# EAGLE design bpf-L-band-BPF-A1340+ (EAGLE 9.2.2)
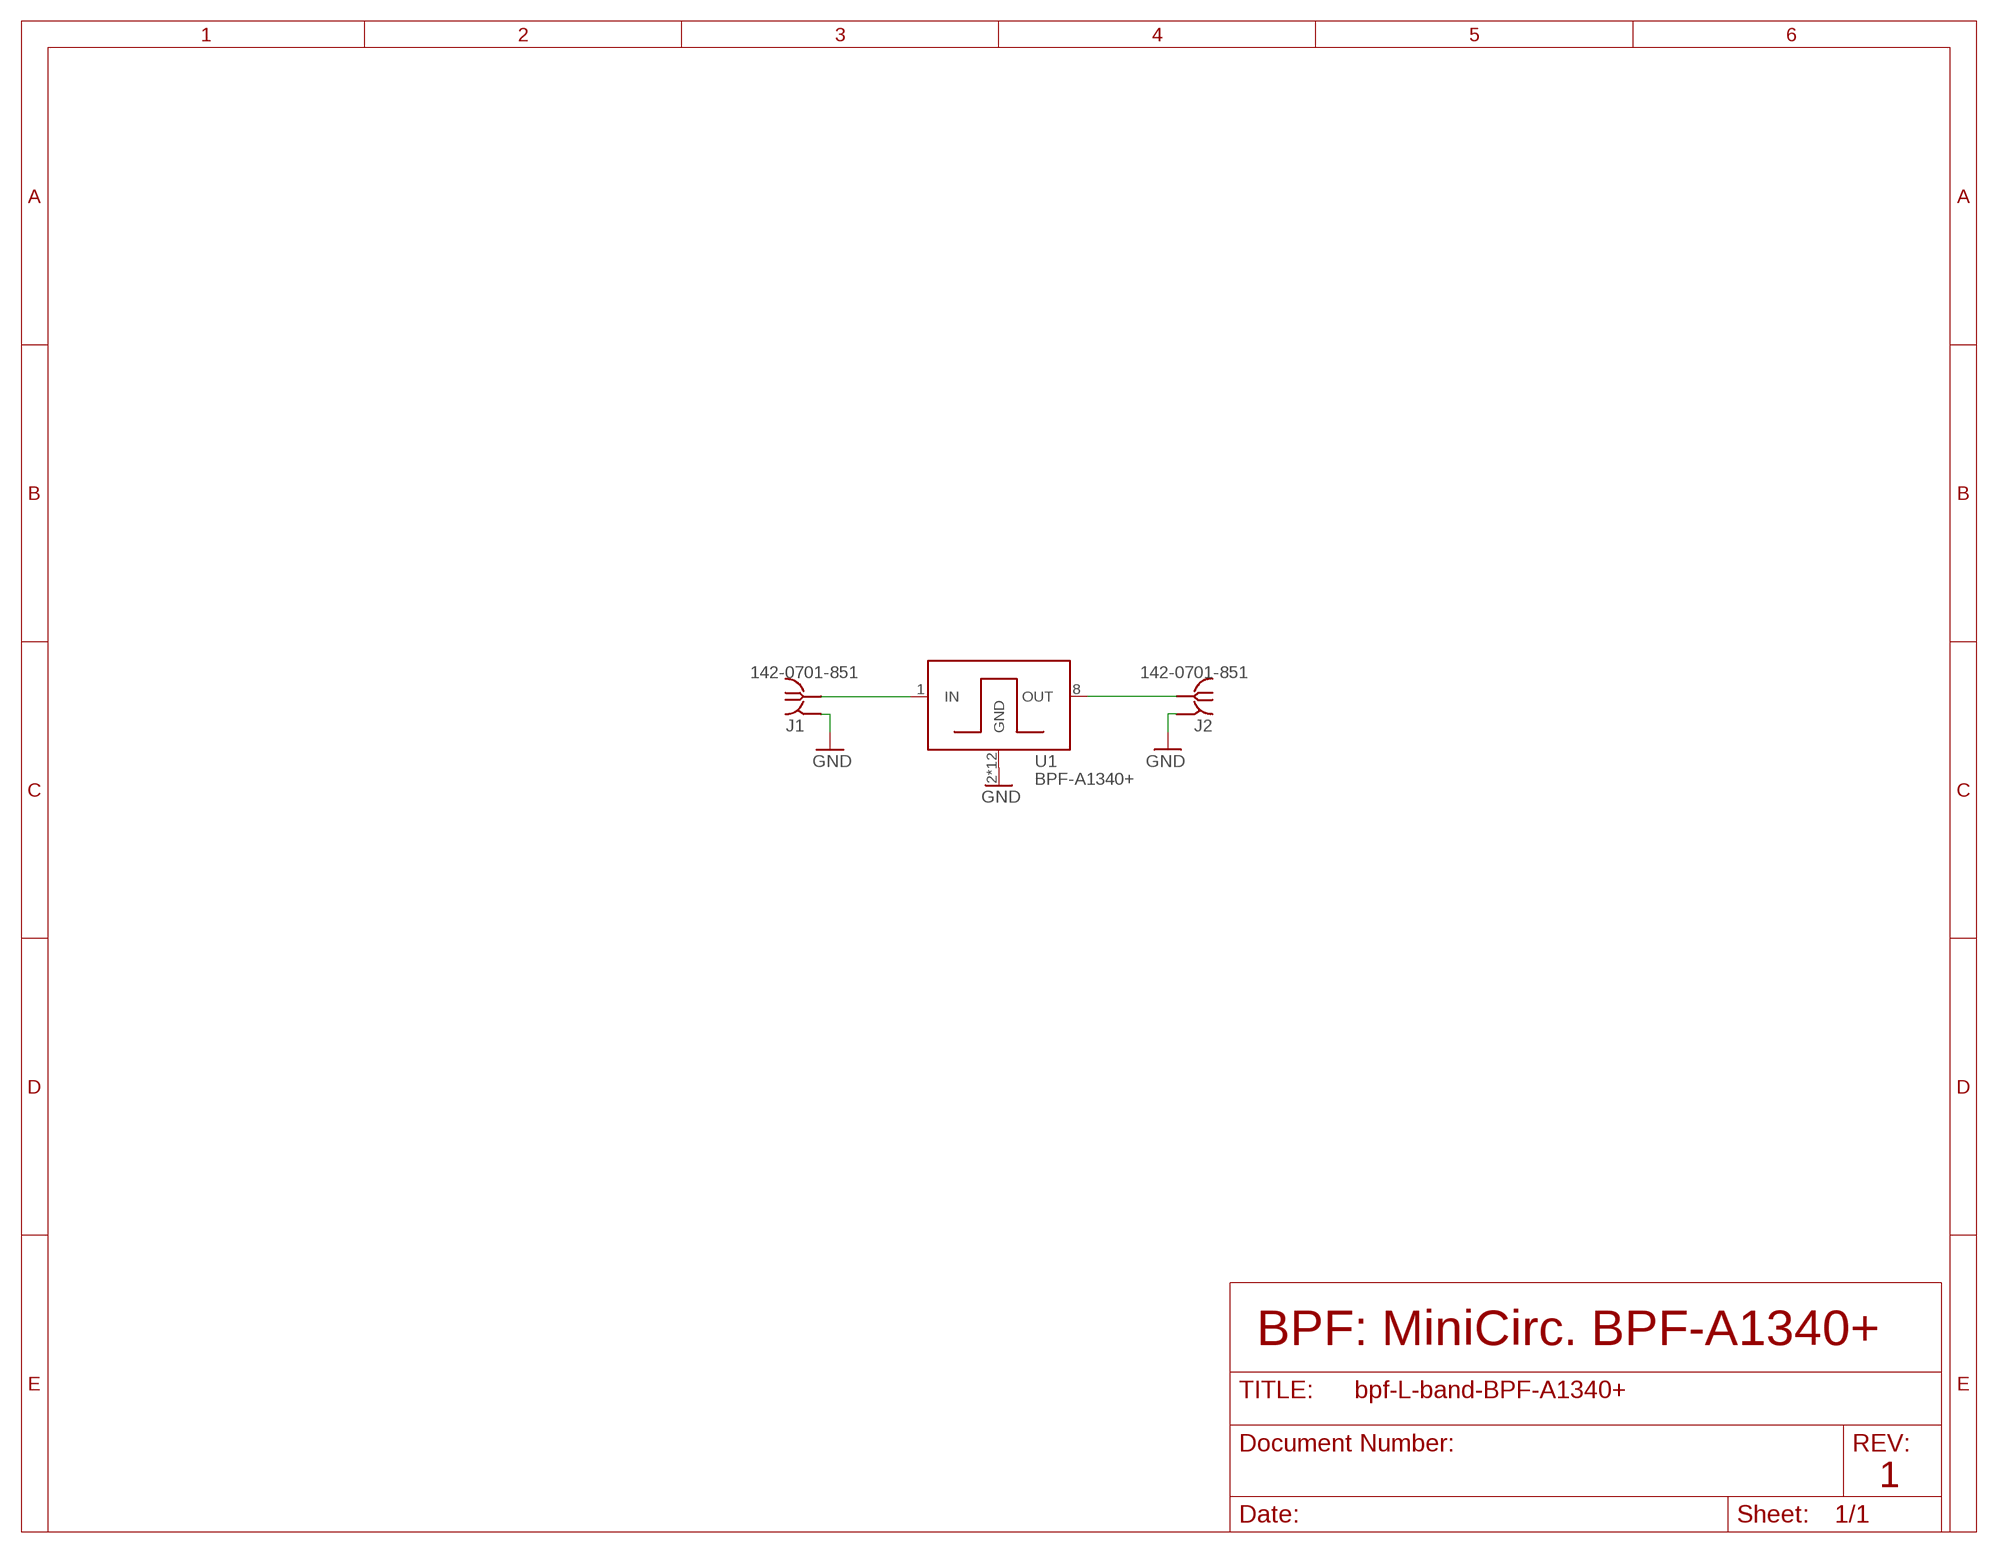
[diagram p0: schematic, sheet 1]

## Parts
J1  142-0701-851  [142-0701-851]
J2  142-0701-851  [142-0701-851]
U1  BPF-A1340+  [BPF-A1340+]

## Nets
GND: J1.GND1(GND) J1.GND2(GND) J1.GND3(GND) J1.GND4(GND) J2.GND1(GND) J2.GND2(GND) J2.GND3(GND) J2.GND4(GND) U1.2(GND) U1.3(GND) U1.4(GND) U1.5(GND) U1.6(GND) U1.7(GND) U1.9(GND) U1.10(GND) U1.11(GND) U1.12(GND) U1.13(GND) U1.14(GND)
RF-IN [RF]: J1.RF1(RF) U1.1(IN)
RF-OUT [RF]: J2.RF1(RF) U1.8(OUT)

## Notes on the sheet
- BPF: MiniCirc. BPF-A1340+
- 1

## Library data of the parts
J1 J2 = J-Cinch-142-0701-851-SMA-end-launch:142-0701-851: SMA Jack 50Ω - End Launch Source: Datasheet <https://belfuse.com/resources/productinformations/cinchconnectivitysolutions/johnson/pi-ccs-john-142-0701-851.pdf>
U1 = U-MiniCirc-BPF-A1340+-BPF:BPF-A1340+: Bandpass Filter Band: 1000 to 1800 MHz Source: Datasheet <https://www.minicircuits.com/pdfs/BPF-A1340+.pdf>

## Net classes
1 RF: clearance 0.31 mm

## Board
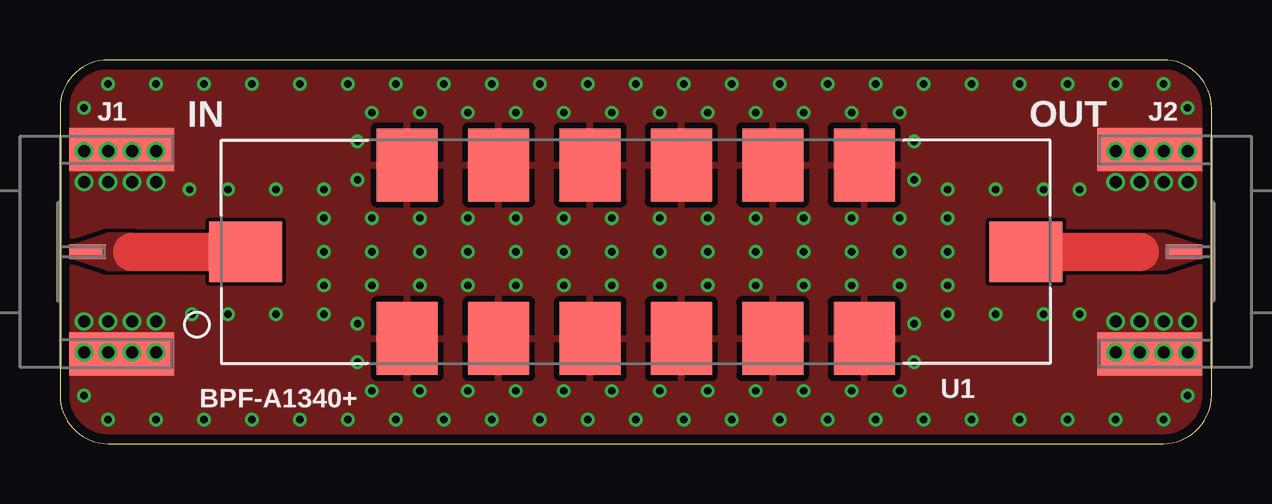
[diagram p1: board, top side]
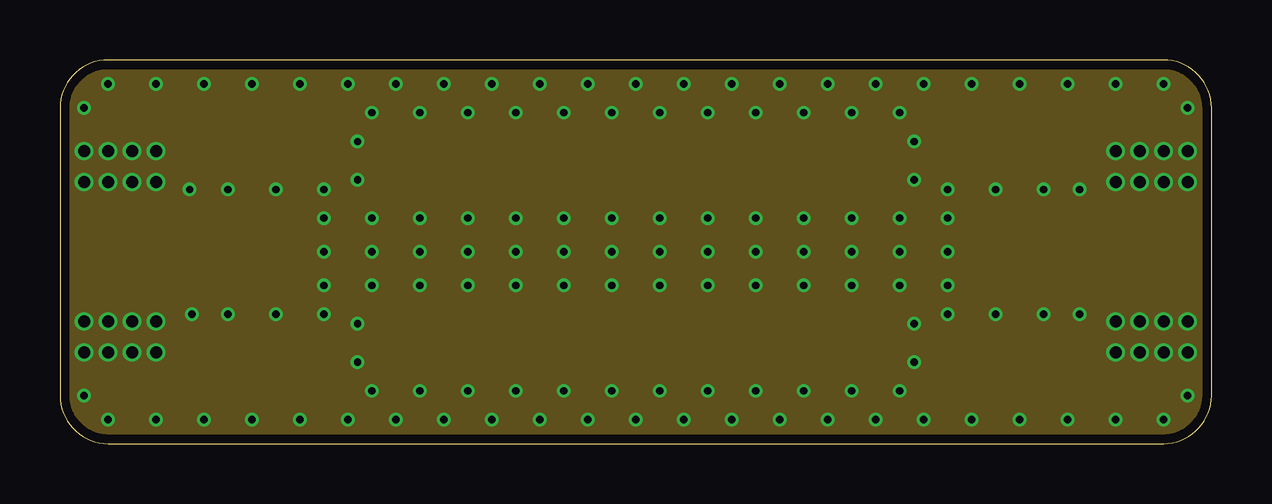
[diagram p2: board, inner layer Route2]
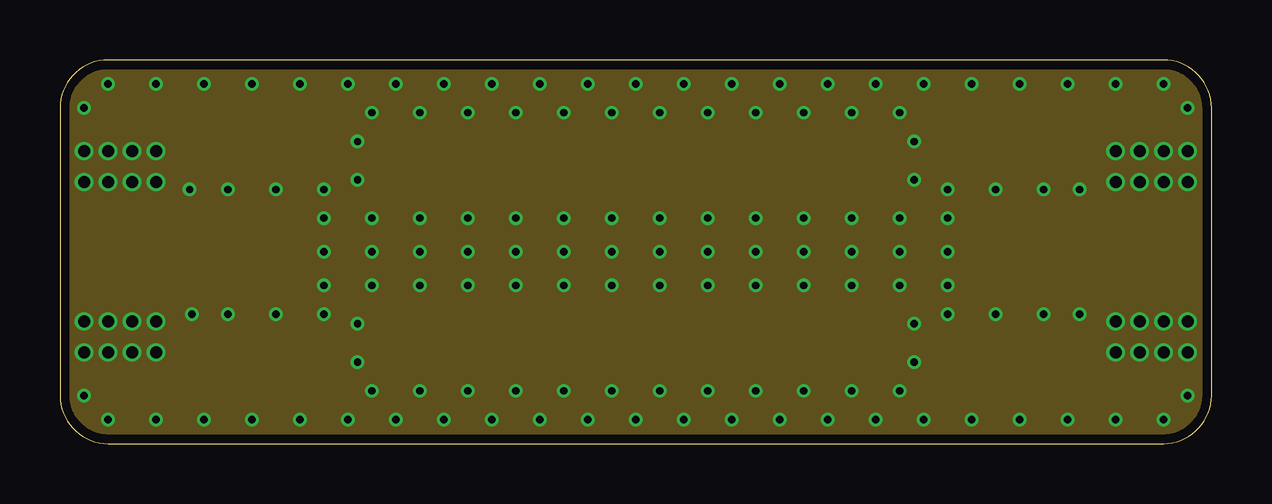
[diagram p3: board, inner layer Route15]
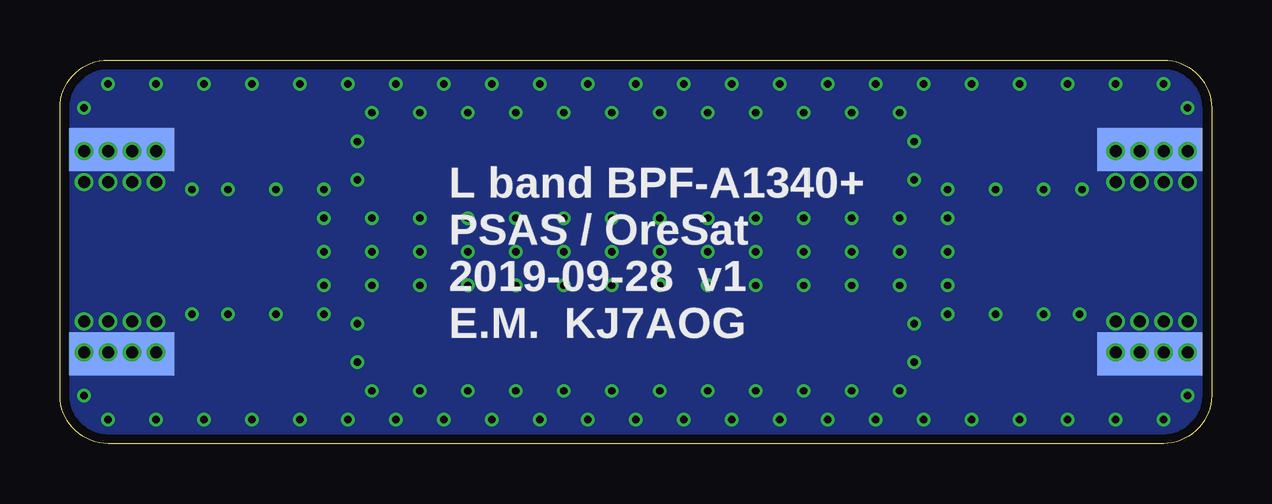
[diagram p4: board, bottom side, seen from below]

Size 48 x 16 mm. Coordinates in mm from the lower left corner, seen from the top.
Outline: 46,16 2,16 arc90 0,14 0,2 arc90 2,0 46,0 arc90 48,2 48,14 arc90 46,16
Copper layers (1*16): Top 0.035559375mm / dielectric 1.6mm / Bottom 0.035559375mm
Design rules "oshpark-2layer-tented": minimum track width 6mil, minimum drill 10mil, track to track 6mil, track to pad 6mil, pad to pad 6mil, via to via 6mil, smd to smd 6mil, copper to edge 15mil, drill to drill 6mil, minimum pad ring 5mil, minimum via ring 5mil, stop-mask expansion 2.5mil, vias tented up to drill 20mil, thermal gap 10mil

### Footprints (pad centres in the part's own frame; a part is rotated, then mirrored left to right if it is on the bottom)
142-0701-851 = smd 1.8 x 4.37: GND1 -4.255,-2.566; GND2 4.255,-2.566 | smd 1.8 x 4.37 bottom: GND3 -4.255,-2.566; GND4 4.255,-2.566 | smd 0.6 x 1.53: RF1 0,-1.146
BPF-A1340+ = smd 3.048 x 2.54: 1 -16.256,0; 8 16.256,0 | smd 2.54 x 3.048: 2 -9.525,-3.619; 3 -5.715,-3.619; 4 -1.905,-3.619; 5 1.905,-3.619; 6 5.715,-3.619; 7 9.525,-3.619; 9 9.525,3.619; 10 5.715,3.619; 11 1.905,3.619; 12 -1.905,3.619; 13 -5.715,3.619; 14 -9.525,3.619

### Placement (x,y rotation side)
J1  0,8 90 top
J2  48,8 270 top
U1  24,8 0 top

### Tracks (layer width: path | path; a pad name or v marks a point on that pad's centre or on a via)
GND  (via drill 0.3, 0.5)
  other vias: 1,3.8 2,3.8 3,3.8 4,3.8 1,5.1 2,5.1 3,5.1 4,5.1 1,12.2 2,12.2 3,12.2 4,12.2 1,10.9 2,10.9 3,10.9 4,10.9 44,3.8 45,3.8 46,3.8 47,3.8 47,5.1 46,5.1 45,5.1 44,5.1 44,12.2 45,12.2 46,12.2 47,12.2 44,10.9 45,10.9 46,10.9 47,10.9 1,2 2,1 4,1 44,1 46,1 47,2 1,14 2,15 4,15 44,15 46,15 47,14 11,8 11,9.4 13,9.4 13,8 11,6.6 13,6.6 15,9.4 17,9.4 19,9.4 21,9.4 23,9.4 25,9.4 27,9.4 29,9.4 31,9.4 33,9.4 35,9.4 37,9.4 37,8 35,8 33,8 31,8 29,8 27,8 25,8 23,8 21,8 19,8 17,8 15,8 15,6.6 17,6.6 19,6.6 21,6.6 23,6.6 25,6.6 27,6.6 29,6.6 31,6.6 33,6.6 35,6.6 37,6.6 9,10.6 11,10.6 7,10.6 5.4,10.6 7,5.4 9,5.4 11,5.4 37,10.6 39,10.6 41,10.6 42.5,10.6 37,5.4 39,5.4 41,5.4 42.5,5.4 5.5,5.4 13,2.2 15,2.2 17,2.2 19,2.2 21,2.2 23,2.2 25,2.2 27,2.2 29,2.2 31,2.2 33,2.2 35,2.2 35.6,5 35.6,3.4 35.6,11 35,13.8 35.6,12.6 33,13.8 31,13.8 29,13.8 27,13.8 25,13.8 23,13.8 21,13.8 19,13.8 17,13.8 15,13.8 13,13.8 12.4,11 12.4,12.6 12.4,5 12.4,3.4 6,15 8,15 10,15 12,15 14,15 16,15 18,15 42,15 40,15 38,15 36,15 34,15 32,15 30,15 28,15 26,15 24,15 22,15 20,15 6,1 8,1 10,1 12,1 14,1 16,1 18,1 20,1 22,1 24,1 26,1 28,1 30,1 32,1 34,1 36,1 38,1 40,1 42,1
  pour Top (rank 2): 0,16 48,16 48,0 0,0
  pour Top (rank 2, no thermals): 0,13.5 5,13.5 5,2.5 0,2.5
  pour Top (rank 2, no thermals): 43,13.5 48,13.5 48,2.5 43,2.5
  pour Bottom: 0,16 48,16 48,0 0,0
  pour Route15: 0,16 48,16 48,0 0,0
  pour Route2: 0,16 48,16 48,0 0,0
  pour Bottom (no thermals): 0,13.5 5,13.5 5,2.5 0,2.5
  pour Bottom (no thermals): 43,13.5 48,13.5 48,2.5 43,2.5
RF-IN
  Top 1.6: U1.1 3,8
  pour Top (no thermals): 3,8.7 2,8.7 0.5,8.2 0.5,7.8 2,7.3 3,7.3
RF-OUT
  Top 1.6: U1.8 45,8
  pour Top (no thermals): 45,8.7 46,8.7 47.5,8.2 47.5,7.8 46,7.3 45,7.3

### Text on the board
tPlace: IN | OUT | BPF-A1340+
bPlace: L band BPF-A1340+ / PSAS / OreSat / 2019-09-28 v1 / E.M. KJ7AOG